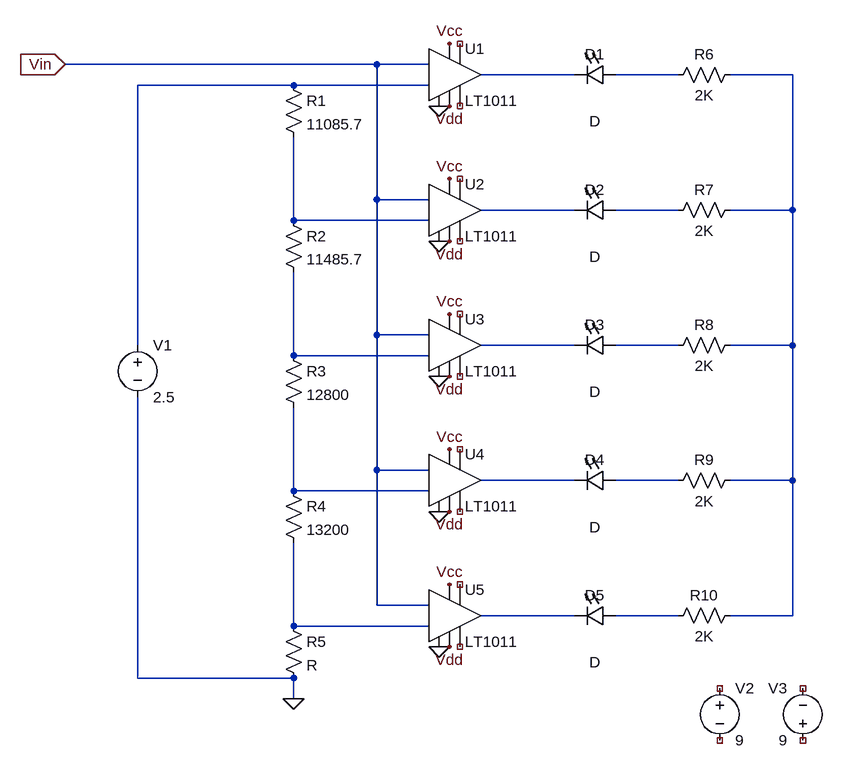
[diagram p0: schematic Komparator1.asc]
Komparator1.asc, the LTspice schematic file:
Version 4
SHEET 1 948 1152
WIRE 256 96 -224 96
WIRE 336 96 256 96
WIRE 560 112 416 112
WIRE 720 112 624 112
WIRE 896 112 800 112
WIRE 128 128 -112 128
WIRE 336 128 128 128
WIRE 256 304 256 96
WIRE 336 304 256 304
WIRE 560 320 416 320
WIRE 720 320 624 320
WIRE 896 320 896 112
WIRE 896 320 800 320
WIRE 128 336 128 208
WIRE 336 336 128 336
WIRE 256 512 256 304
WIRE 336 512 256 512
WIRE -112 528 -112 128
WIRE 560 528 416 528
WIRE 720 528 624 528
WIRE 896 528 896 320
WIRE 896 528 800 528
WIRE 128 544 128 416
WIRE 336 544 128 544
WIRE 256 720 256 512
WIRE 336 720 256 720
WIRE 560 736 416 736
WIRE 720 736 624 736
WIRE 896 736 896 528
WIRE 896 736 800 736
WIRE 128 752 128 624
WIRE 336 752 128 752
WIRE 256 928 256 720
WIRE 336 928 256 928
WIRE 560 944 416 944
WIRE 720 944 624 944
WIRE 896 944 896 736
WIRE 896 944 800 944
WIRE 128 960 128 832
WIRE 336 960 128 960
WIRE -112 1040 -112 608
WIRE 128 1040 -112 1040
WIRE 128 1072 128 1040
FLAG 352 992 0
FLAG 352 784 0
FLAG 352 576 0
FLAG 352 368 0
FLAG 352 160 0
FLAG -224 96 Vin
IOPIN -224 96 In
FLAG 368 64 Vcc
FLAG 368 272 Vcc
FLAG 368 480 Vcc
FLAG 368 688 Vcc
FLAG 368 896 Vcc
FLAG 368 160 Vdd
FLAG 368 368 Vdd
FLAG 368 576 Vdd
FLAG 368 784 Vdd
FLAG 368 992 Vdd
FLAG 128 1072 0
SYMBOL LT1011 368 112 R0
SYMATTR InstName U1
SYMBOL LT1011 368 320 R0
SYMATTR InstName U2
SYMBOL LT1011 368 528 R0
SYMATTR InstName U3
SYMBOL LT1011 368 736 R0
SYMATTR InstName U4
SYMBOL LT1011 368 944 R0
SYMATTR InstName U5
SYMBOL res 112 112 R0
SYMATTR InstName R1
SYMATTR Value 11085.7
SYMBOL res 112 528 R0
SYMATTR InstName R3
SYMATTR Value 12800
SYMBOL res 112 320 R0
SYMATTR InstName R2
SYMATTR Value 11485.7
SYMBOL res 112 736 R0
SYMATTR InstName R4
SYMATTR Value 13200
SYMBOL res 112 944 R0
SYMATTR InstName R5
SYMBOL LED 624 96 R90
WINDOW 0 0 32 VBottom 2
WINDOW 3 72 32 VTop 2
SYMATTR InstName D1
SYMBOL LED 624 304 R90
WINDOW 0 0 32 VBottom 2
WINDOW 3 72 32 VTop 2
SYMATTR InstName D2
SYMBOL LED 624 512 R90
WINDOW 0 0 32 VBottom 2
WINDOW 3 72 32 VTop 2
SYMATTR InstName D3
SYMBOL LED 624 720 R90
WINDOW 0 0 32 VBottom 2
WINDOW 3 72 32 VTop 2
SYMATTR InstName D4
SYMBOL LED 624 928 R90
WINDOW 0 0 32 VBottom 2
WINDOW 3 72 32 VTop 2
SYMATTR InstName D5
SYMBOL res 816 96 R90
WINDOW 0 0 56 VBottom 2
WINDOW 3 32 56 VTop 2
SYMATTR InstName R6
SYMATTR Value 2K
SYMBOL res 816 304 R90
WINDOW 0 0 56 VBottom 2
WINDOW 3 32 56 VTop 2
SYMATTR InstName R7
SYMATTR Value 2K
SYMBOL res 816 512 R90
WINDOW 0 0 56 VBottom 2
WINDOW 3 32 56 VTop 2
SYMATTR InstName R8
SYMATTR Value 2K
SYMBOL res 816 720 R90
WINDOW 0 0 56 VBottom 2
WINDOW 3 32 56 VTop 2
SYMATTR InstName R9
SYMATTR Value 2K
SYMBOL res 816 928 R90
WINDOW 0 0 56 VBottom 2
WINDOW 3 32 56 VTop 2
SYMATTR InstName R10
SYMATTR Value 2K
SYMBOL voltage -112 512 R0
SYMATTR InstName V1
SYMATTR Value 2.5
SYMBOL voltage 784 1040 R0
SYMATTR InstName V2
SYMATTR Value 9
SYMBOL voltage 912 1152 R180
WINDOW 0 24 96 Left 2
WINDOW 3 24 16 Left 2
SYMATTR InstName V3
SYMATTR Value 9

The netlist it stands for:
* Komparator1.asc
XU1 0 N004 Vin Vdd NC_01 NC_02 N001 Vcc LT1011
XU2 0 N007 Vin Vdd NC_03 NC_04 N005 Vcc LT1011
XU3 0 N010 Vin Vdd NC_05 NC_06 N008 Vcc LT1011
XU4 0 N013 Vin Vdd NC_07 NC_08 N011 Vcc LT1011
XU5 0 N016 Vin Vdd NC_09 NC_10 N014 Vcc LT1011
R1 N004 N007 11085.7
R3 N010 N013 12800
R2 N007 N010 11485.7
R4 N013 N016 13200
R5 N016 0 R
D1 N002 N001 D
D2 N006 N005 D
D3 N009 N008 D
D4 N012 N011 D
D5 N015 N014 D
R6 N003 N002 2K
R7 N003 N006 2K
R8 N003 N009 2K
R9 N003 N012 2K
R10 N003 N015 2K
V1 N004 0 2.5
V2 NC_11 NC_12 9
V3 NC_13 NC_14 9
.model D D
.lib standard.dio
.lib LTC1.lib
.backanno
.end